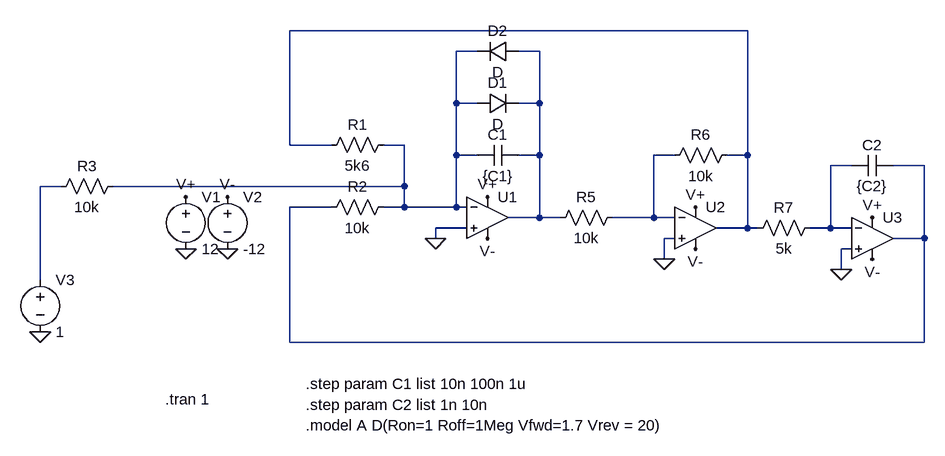
[diagram p0: schematic VdPDiode.asc]
VdPDiode.asc, the LTspice schematic file:
Version 4
SHEET 1 904 680
WIRE 624 16 -80 16
WIRE 208 48 176 48
WIRE 304 48 272 48
WIRE 176 128 176 48
WIRE 208 128 176 128
WIRE 304 128 304 48
WIRE 304 128 272 128
WIRE -80 192 -80 16
WIRE -16 192 -80 192
WIRE 96 192 64 192
WIRE 176 208 176 128
WIRE 208 208 176 208
WIRE 304 208 304 128
WIRE 304 208 272 208
WIRE 512 208 480 208
WIRE 624 208 624 16
WIRE 624 208 592 208
WIRE 784 224 752 224
WIRE 896 224 848 224
WIRE -432 256 -464 256
WIRE 96 256 96 192
WIRE 96 256 -352 256
WIRE -16 288 -80 288
WIRE 96 288 96 256
WIRE 96 288 64 288
WIRE 176 288 176 208
WIRE 176 288 96 288
WIRE 192 288 176 288
WIRE 304 304 304 208
WIRE 304 304 256 304
WIRE 336 304 304 304
WIRE 480 304 480 208
WIRE 480 304 416 304
WIRE 512 304 480 304
WIRE 192 320 144 320
WIRE 624 320 624 208
WIRE 624 320 576 320
WIRE 640 320 624 320
WIRE 752 320 752 224
WIRE 752 320 720 320
WIRE 784 320 752 320
WIRE 144 336 144 320
WIRE 512 336 496 336
WIRE 896 336 896 224
WIRE 896 336 848 336
WIRE 784 352 768 352
WIRE 496 368 496 336
WIRE 768 384 768 352
WIRE -464 400 -464 256
WIRE -80 496 -80 288
WIRE 896 496 896 336
WIRE 896 496 -80 496
FLAG 144 336 0
FLAG -240 352 0
FLAG -176 352 0
FLAG -240 272 V+
FLAG 224 272 V+
FLAG -176 272 V-
FLAG 224 336 V-
FLAG 544 288 V+
FLAG 544 352 V-
FLAG 816 304 V+
FLAG 816 368 V-
FLAG -464 480 0
FLAG 496 368 0
FLAG 768 384 0
SYMBOL res 80 176 R90
WINDOW 0 0 56 VBottom 2
WINDOW 3 32 56 VTop 2
SYMATTR InstName R1
SYMATTR Value 5k6
SYMBOL res 80 272 R90
WINDOW 0 0 56 VBottom 2
WINDOW 3 32 56 VTop 2
SYMATTR InstName R2
SYMATTR Value 10k
SYMBOL cap 272 192 R90
WINDOW 0 0 32 VBottom 2
WINDOW 3 32 32 VTop 2
SYMATTR InstName C1
SYMATTR Value {C1}
SYMBOL res 432 288 R90
WINDOW 0 0 56 VBottom 2
WINDOW 3 32 56 VTop 2
SYMATTR InstName R5
SYMATTR Value 10k
SYMBOL res 608 192 R90
WINDOW 0 0 56 VBottom 2
WINDOW 3 32 56 VTop 2
SYMATTR InstName R6
SYMATTR Value 10k
SYMBOL res 736 304 R90
WINDOW 0 0 56 VBottom 2
WINDOW 3 32 56 VTop 2
SYMATTR InstName R7
SYMATTR Value 5k
SYMBOL cap 848 208 R90
WINDOW 0 0 32 VBottom 2
WINDOW 3 32 32 VTop 2
SYMATTR InstName C2
SYMATTR Value {C2}
SYMBOL OpAmps\\UniversalOpamp2 224 304 R0
SYMATTR InstName U1
SYMATTR SpiceModel level.3a
SYMBOL voltage -240 256 R0
WINDOW 123 0 0 Left 0
WINDOW 39 0 0 Left 0
SYMATTR InstName V1
SYMATTR Value 12
SYMBOL voltage -176 256 R0
WINDOW 123 0 0 Left 0
WINDOW 39 0 0 Left 0
SYMATTR InstName V2
SYMATTR Value -12
SYMBOL OpAmps\\UniversalOpamp2 544 320 R0
SYMATTR InstName U2
SYMATTR SpiceModel level.3a
SYMBOL OpAmps\\UniversalOpamp2 816 336 R0
SYMATTR InstName U3
SYMBOL voltage -464 384 R0
WINDOW 123 0 0 Left 0
WINDOW 39 0 0 Left 0
SYMATTR InstName V3
SYMATTR Value 1
SYMBOL res -336 240 R90
WINDOW 0 0 56 VBottom 2
WINDOW 3 32 56 VTop 2
SYMATTR InstName R3
SYMATTR Value 10k
SYMBOL diode 208 144 R270
WINDOW 0 32 32 VTop 2
WINDOW 3 0 32 VBottom 2
SYMATTR InstName D1
SYMBOL diode 272 32 R90
WINDOW 0 0 32 VBottom 2
WINDOW 3 32 32 VTop 2
SYMATTR InstName D2
TEXT -56 560 Left 2 !.step param C1 list 10n 100n 1u
TEXT -272 584 Left 2 !.tran 1
TEXT -56 592 Left 2 !.step param C2 list 1n 10n
TEXT -56 624 Left 2 !.model A D(Ron=1 Roff=1Meg Vfwd=1.7 Vrev = 20)

The netlist it stands for:
* VdPDiode.asc
R1 N002 N001 5k6
R2 N002 N006 10k
C1 N003 N002 {C1}
R5 N004 N003 10k
R6 N001 N004 10k
R7 N005 N001 5k
C2 N006 N005 {C2}
XU1 0 N002 V+ V- N003 level.3a Avol=1Meg GBW=10Meg Slew=10Meg ilimit=25m rail=0 Vos=0 phimargin=45 en=0 enk=0 in=0 ink=0 Rin=500Meg  ; pins IN+ IN- V+ V- OUT
V1 V+ 0 12
V2 V- 0 -12
XU2 0 N004 V+ V- N001 level.3a Avol=1Meg GBW=10Meg Slew=10Meg ilimit=25m rail=0 Vos=0 phimargin=45 en=0 enk=0 in=0 ink=0 Rin=500Meg  ; pins IN+ IN- V+ V- OUT
XU3 0 N005 V+ V- N006 level.2 Avol=1Meg GBW=10Meg Slew=10Meg ilimit=25m rail=0 Vos=0 phimargin=45 en=0 enk=0 in=0 ink=0 Rin=500Meg  ; pins IN+ IN- V+ V- OUT
V3 N007 0 1
R3 N002 N007 10k
D1 N002 N003 D
D2 N003 N002 D
.model D D
.lib standard.dio
.step param C1 list 10n 100n 1u
.tran 1
.step param C2 list 1n 10n
.model A D(Ron=1 Roff=1Meg Vfwd=1.7 Vrev = 20)
.lib UniversalOpamps2.sub
.backanno
.end